# EAGLE schematic dual power supply (EAGLE 9.6.2)
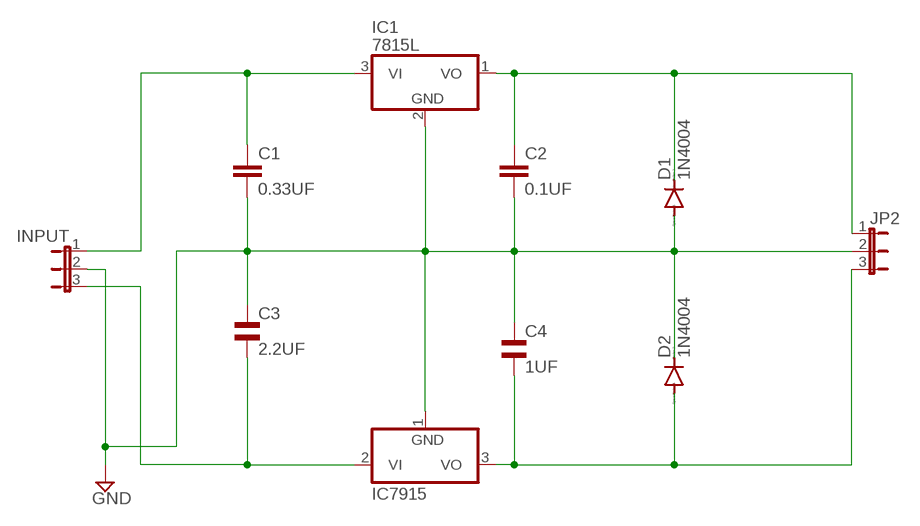
[diagram p0: schematic, sheet 1]

## Parts
C1  0.33UF  C2.5/2  [C2.5-2]
C2  0.1UF  C2.5/2  [C2.5-2]
C3  2.2UF  EL-BI25-10AXIAL  [EU25-10]
C4  1UF  EL-BI25-10AXIAL  [EU25-10]
D1  1N4004  [DO41-10]
D2  1N4004  [DO41-10]
IC1  7815L  [TO92]
IC7915  7915L  [TO92]
INPUT  JP2E  [JP2]
JP2  JP2E  [JP2]

## Nets
IC7815: C1.2 C2.2 C3.1 C4.1 D1.A D2.C IC1.2(GND) IC7915.1(GND) INPUT.2 JP2.2 ; supply symbol labelled GND
N$1: C2.1 D1.C IC1.1(VO) JP2.1
N$2: C3.2 IC7915.2(VI) INPUT.3
N$3: C1.1 IC1.3(VI) INPUT.1
N$4: C4.2 D2.A IC7915.3(VO) JP2.3

## Library data of the parts
C1 C2 = capacitor-wima:C: CAPACITOR naming: grid - package width
C3 C4 = rcl:EL-: BIPOLAR ELECTROLYTIC CAPACITOR; SPICEPREFIX: C
D1 D2 = diode:1N4004: DIODE general purpose rectifier, 1 A
IC1 = linear:78*: Positive VOLTAGE REGULATOR Source: http://cache.national.com/ds/LM/LM78L05.pdf http://www.fairchildsemi.com/ds/LM/LM7805.pdf
IC7915 = linear:79*: Negative VOLTAGE REGULATOR
INPUT JP2 = jumper:JP2E: JUMPER